# EAGLE design ledshield (EAGLE 7.2.0)
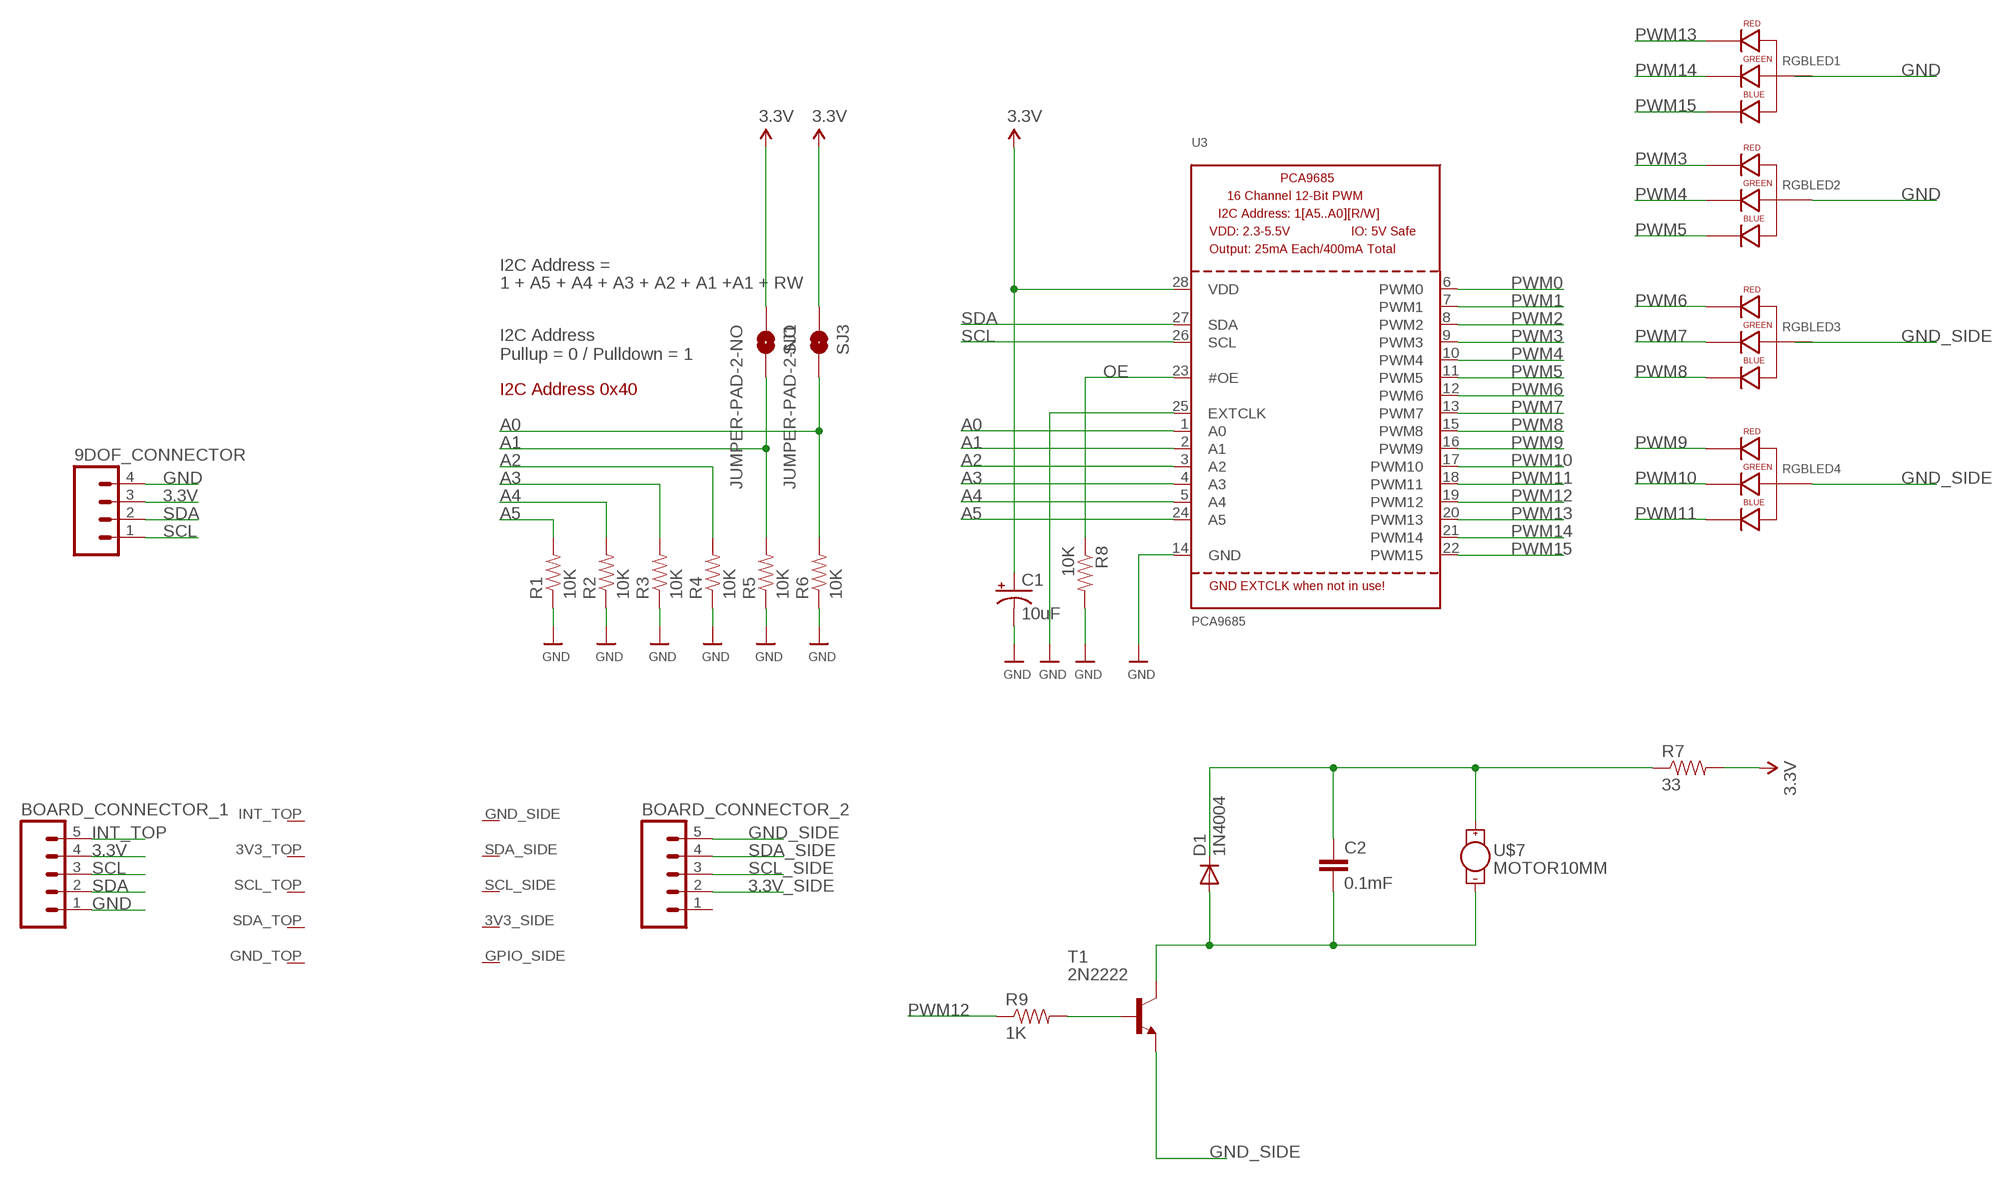
[diagram p0: schematic, sheet 1]

## Parts
9DOF_CONNECTOR  M041.27MM  [1X04-1.27MM]
BOARD_CONNECTOR_1  M051.27MM  [1X05-1.27MM]
BOARD_CONNECTOR_2  M051.27MM  [1X05-1.27MM]
C1  10uF  CAP_POL1206  [EIA3216]
C2  0.1mF  CAP1206  [1206]
D1  1N4004  [DO41-10]
R1  10K  RESISTOR1206  [1206]
R2  10K  RESISTOR1206  [1206]
R3  10K  RESISTOR1206  [1206]
R4  10K  RESISTOR1206  [1206]
R5  10K  RESISTOR1206  [1206]
R6  10K  RESISTOR1206  [1206]
R7  33  RESISTOR1206  [1206]
R8  10K  RESISTOR1206  [1206]
R9  1K  RESISTOR1206  [1206]
RGBLED1  LED-RGB-CA-THRUCLEAR  [LED-RGB-THRU]
RGBLED2  LED-RGB-CA-THRUCLEAR  [LED-RGB-THRU]
RGBLED3  LED-RGB-CA-THRUCLEAR  [LED-RGB-THRU]
RGBLED4  LED-RGB-CA-THRUCLEAR  [LED-RGB-THRU]
SJ1  JUMPER-PAD-2-NO  [PAD-JUMPER-2-NO_NO_SILK]
SJ3  JUMPER-PAD-2-NO  [PAD-JUMPER-2-NO_NO_SILK]
T1  2N2222  [TO92-EBC-OVAL]
U3  PCA9685  [TSSOP28]
U$1  IOT_MODULE_MAIN_V2_PTH  [IOT_MODULE_MAIN_V3_PTH]
U$7  MOTOR10MM  [VIBE-MOTOR-10MM]

## Nets
3.3V: 9DOF_CONNECTOR.3 BOARD_CONNECTOR_1.4 C1.A(+) R7.2 SJ1.1 SJ3.1 U3.28(VDD)
3.3V_SIDE: BOARD_CONNECTOR_2.2
A0: R6.2 SJ3.2 U3.1(A0)
A1: R5.2 SJ1.2 U3.2(A1)
A2: R4.2 U3.3(A2)
A3: R3.2 U3.4(A3)
A4: R2.2 U3.5(A4)
A5: R1.2 U3.24(A5)
GND: 9DOF_CONNECTOR.4 BOARD_CONNECTOR_1.1 C1.C(-) R1.1 R2.1 R3.1 R4.1 R5.1 R6.1 R8.2 RGBLED2.2(ANODE) U3.14(GND) U3.25(EXTCLK)
GND_SIDE: BOARD_CONNECTOR_2.5 RGBLED4.2(ANODE) T1.E
INT_TOP: BOARD_CONNECTOR_1.5
N$1: C2.1 D1.C R7.1 U$7.+
N$2: C2.2 D1.A T1.C U$7.-
N$3: R9.2 T1.B
OE: R8.1 U3.23(#OE)
PWM0: U3.6(PWM0)
PWM1: U3.7(PWM1)
PWM2: U3.8(PWM2)
PWM3: RGBLED2.1(RED_CATHODE) U3.9(PWM3)
PWM4: RGBLED2.3(GREEN_CATHODE) U3.10(PWM4)
PWM5: RGBLED2.4(BLUE_CATHODE) U3.11(PWM5)
PWM6: RGBLED3.1(RED_CATHODE) U3.12(PWM6)
PWM7: RGBLED3.3(GREEN_CATHODE) U3.13(PWM7)
PWM8: RGBLED3.4(BLUE_CATHODE) U3.15(PWM8)
PWM9: RGBLED4.1(RED_CATHODE) U3.16(PWM9)
PWM10: RGBLED4.3(GREEN_CATHODE) U3.17(PWM10)
PWM11: RGBLED4.4(BLUE_CATHODE) U3.18(PWM11)
PWM12: R9.1 U3.19(PWM12)
PWM13: RGBLED1.1(RED_CATHODE) U3.20(PWM13)
PWM14: RGBLED1.3(GREEN_CATHODE) U3.21(PWM14)
PWM15: RGBLED1.4(BLUE_CATHODE) U3.22(PWM15)
SCL: 9DOF_CONNECTOR.1 BOARD_CONNECTOR_1.3 U3.26(SCL)
SCL_SIDE: BOARD_CONNECTOR_2.3
SDA: 9DOF_CONNECTOR.2 BOARD_CONNECTOR_1.2 U3.27(SDA)
SDA_SIDE: BOARD_CONNECTOR_2.4
Unconnected: BOARD_CONNECTOR_2.1 RGBLED1.2(ANODE) RGBLED3.2(ANODE) U$1.3V3_SIDE U$1.3V3_TOP U$1.GND_SIDE U$1.GND_TOP U$1.GPIO_SIDE U$1.INT_TOP U$1.SCL_SIDE U$1.SCL_TOP U$1.SDA_SIDE U$1.SDA_TOP

## Notes on the sheet
- I2C Address =
- 1 + A5 + A4 + A3 + A2 + A1 +A1 + RW
- I2C Address
  Pullup = 0 / Pulldown = 1
- I2C Address 0x40

## Library data of the parts
9DOF_CONNECTOR = SparkFun-Connectors:M04: Header 4 Standard 4-pin 0.1" header. Use with straight break away headers (SKU : PRT-00116), right angle break away headers (PRT-00553), swiss pins (PRT-00743), machine pins (PRT-00117), and female headers (PRT-00115). Molex polarized connector foot print use with SKU : PRT-08231 with associated crimp pins and housings. 1MM SMD Version SKU: PRT-10208
BOARD_CONNECTOR_1 BOARD_CONNECTOR_2 = SparkFun-Connectors:M05: Header 5 Standard 5-pin 0.1" header. Use with straight break away headers (SKU : PRT-00116), right angle break away headers (PRT-00553), swiss pins (PRT-00743), machine pins (PRT-00117), and female headers (PRT-00115). Molex polarized connector foot print use with SKU : PRT-08230 with associated crimp pins and housings.
C1 = SparkFun-Passives:CAP_POL: Capacitor Polarized These are standard SMD and PTH capacitors. Normally 10uF, 47uF, and 100uF in electrolytic and tantalum varieties. Always verify the external diameter of the through hole cap, it varies with capacity, voltage, and manufacturer. The EIA devices should be standard.
C2 = SparkFun-Capacitors:CAP: Capacitor Standard 0603 ceramic capacitor, and 0.1" leaded capacitor.
D1 = adafruit:1N4004: DIODE General purpose 1N400x type rectifier (With bigger pads) http://www.ladyada.net/library/pcb/eaglelibrary.html
R1-R9 = SparkFun-Resistors:RESISTOR: Resistor Basic schematic elements and footprints for 0603, 1206, and PTH resistors.
RGBLED1-RGBLED4 = SparkFun-LED:LED-RGB-CA-THRU: RGB Through-hole common anode SparkFun store front COM-10821 (diffuse) COM-10820 (clear); PROD_ID: DIO-10631
SJ1 SJ3 = SparkFun-Passives:JUMPER-PAD-2-NO
T1 = adafruit:2N2222: NPN TRANSISTOR Big oval pads
U3 = microbuilder:PCA9685: PCA9685 - 16 Channel 12-Bit I2C PWM Controller 5.0V tolerant 16 channel, 12-bit I2C PWM controller with 25mA per output (max. 400mA total) Digikey: 568-5931-1-ND
U$1 = Mlab_ProEx2015:IOT_MODULE_MAIN_V2
U$7 = SparkFun-Electromechanical:MOTOR: Vibration Motor- ROB-08449 Physical dimension and wire connections for this powerful vibration motor. Motor has a self adhesive backing.

## Board
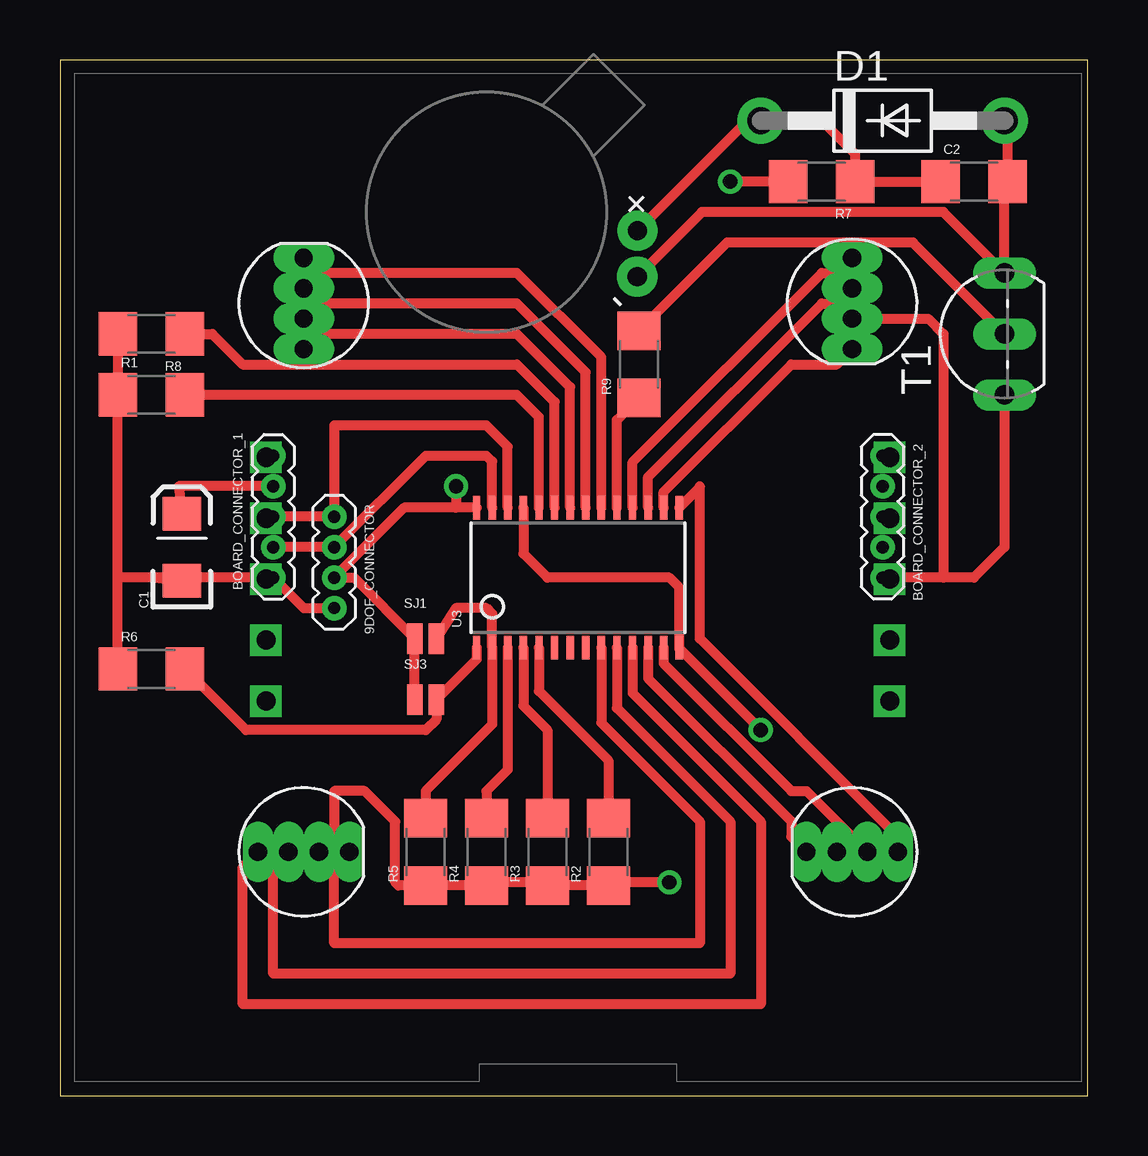
[diagram p1: board, top side]
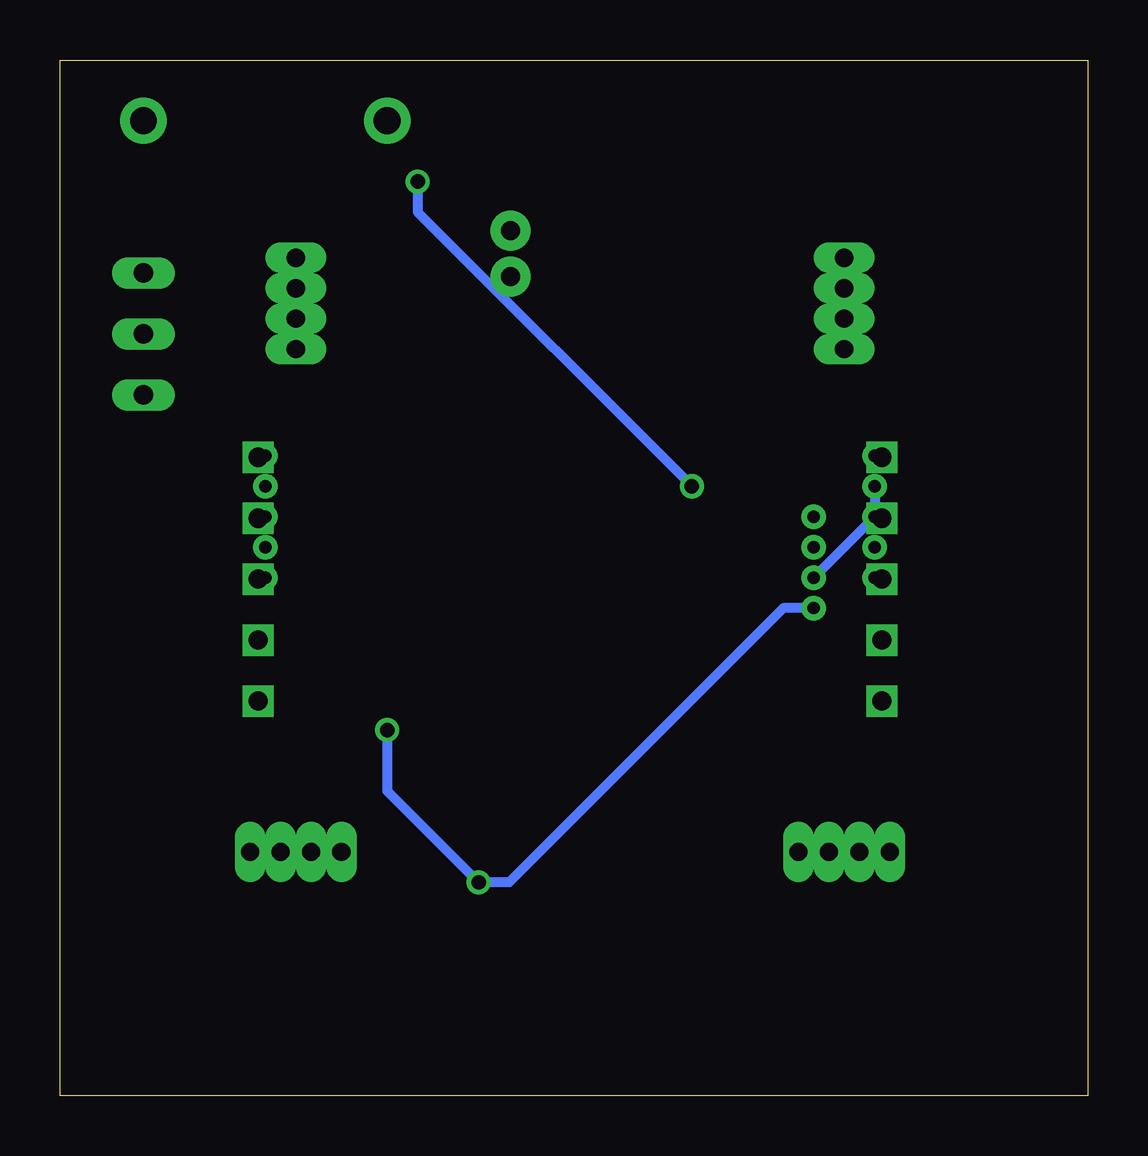
[diagram p2: board, bottom side, seen from below]

Size 42.85 x 43.17 mm. Coordinates in mm from the lower left corner, seen from the top.
Outline: 0,0 42.85,0 42.85,43.17 0,43.17 0,0
Copper layers (1*16): Top 0.035mm / dielectric 1.5mm / Bottom 0.035mm
Design rules "default": minimum track width 10mil, minimum drill 24mil, track to track 8mil, track to pad 8mil, pad to pad 8mil, via to via 8mil, smd to smd 8mil, copper to edge 40mil, drill to drill 8mil, minimum pad ring 10mil, minimum via ring 8mil, stop-mask expansion 4mil, vias tented up to drill 0mil, thermal gap 10mil

### Footprints (pad centres in the part's own frame; a part is rotated, then mirrored left to right if it is on the bottom)
1X04-1.27MM = drill 0.508 pad 1: 1 0,0; 2 1.27,0; 3 2.54,0; 4 3.81,0
1X05-1.27MM = drill 0.508 pad 1: 1 0,0; 2 1.27,0; 3 2.54,0; 4 3.81,0; 5 5.08,0
EIA3216 = smd 1.4 x 1.6: A 1.4,0; C -1.4,0
1206 = smd 1.6 x 1.8: 1 -1.4,0; 2 1.4,0
DO41-10 = drill 1.118 pad 1.93: A 5.08,0; C -5.08,0
LED-RGB-THRU = drill 0.762 pad 0.889 long: 1 1.905,0; 2 0.635,0; 3 -0.635,0; 4 -1.905,0
PAD-JUMPER-2-NO_NO_SILK = smd 0.635 x 1.27: 1 -0.45,0; 2 0.45,0
TO92-EBC-OVAL = drill 0.813 long: B 0,-1.27; C 2.54,-1.27; E -2.54,-1.27
TSSOP28 = smd 0.305 x 0.991: 1 -4.225,-2.918; 2 -3.575,-2.918; 3 -2.925,-2.918; 4 -2.275,-2.918; 5 -1.625,-2.918; 6 -0.975,-2.918; 7 -0.325,-2.918; 8 0.325,-2.918; 9 0.975,-2.918; 10 1.625,-2.918; 11 2.275,-2.918; 12 2.925,-2.918; 13 3.575,-2.918; 14 4.225,-2.918; 15 4.225,2.918; 16 3.575,2.918; 17 2.925,2.918; 18 2.275,2.918; 19 1.625,2.918; 20 0.975,2.918; 21 0.325,2.918; 22 -0.325,2.918; 23 -0.975,2.918; 24 -1.625,2.918; 25 -2.275,2.918; 26 -2.925,2.918; 27 -3.575,2.918; 28 -4.225,2.918
IOT_MODULE_MAIN_V3_PTH = drill 0.8 square: 3V3_SIDE 13,-2.601; 3V3_TOP -13,2.479; GND_SIDE 13,5.019; GND_TOP -13,-5.141; GPIO_SIDE 13,-5.141; INT_TOP -13,5.019; SCL_SIDE 13,-0.061; SCL_TOP -13,-0.061; SDA_SIDE 13,2.479; SDA_TOP -13,-2.601
VIBE-MOTOR-10MM = drill 0.8 pad 1.676: + -5,-3.9; - -6.35,-2.54

### Placement (x,y rotation side)
9DOF_CONNECTOR  11.43,24.13 270 top
BOARD_CONNECTOR_1  8.89,21.59 90 top
BOARD_CONNECTOR_2  34.29,26.67 270 top
C1  5.08,22.86 90 top
C2  38.1,38.1 0 top
D1  34.29,40.64 0 top
R1  3.81,29.21 0 top
R2  22.86,10.16 90 top
R3  20.32,10.16 90 top
R4  17.78,10.16 90 top
R5  15.24,10.16 90 top
R6  3.81,17.78 0 top
R7  31.75,38.1 180 top
R8  3.81,31.75 180 top
R9  24.13,30.48 90 top
RGBLED1  10.16,33.02 90 top
RGBLED2  10.16,10.16 0 top
RGBLED3  33.02,10.16 180 top
RGBLED4  33.02,33.02 270 top
SJ1  15.24,19.05 0 top
SJ3  15.24,16.51 0 top
T1  38.1,31.75 90 top
U3  21.59,21.59 0 top
U$1  21.59,21.59 0 top
U$7  17.78,36.83 135 top

### Tracks (layer width: path | path; a pad name or v marks a point on that pad's centre or on a via)
3.3V  (via drill 0.6)
  Top 0.406: BOARD_CONNECTOR_1.4 4.95,25.4 C1.A | SJ3.1 SJ1.1 12.25,21.59 9DOF_CONNECTOR.3 14.35,24.51 16.51,24.51 | U3.28 16.51,24.51 | R7.2 v27.94,38.1 | v16.51,25.4 16.51,24.51
  Bottom 0.406: BOARD_CONNECTOR_1.4 8.89,24.13 9DOF_CONNECTOR.3 | v27.94,38.1 27.94,36.83 v16.51,25.4
A0
  Top 0.406: U3.1 17.36,18.18 SJ3.2 15.69,15.69 15.24,15.24 7.75,15.24 R6.2
A1
  Top 0.406: R5.2 15.24,12.7 18.02,15.47 U3.2 18.02,20.09 17.78,20.32 16.51,20.32 SJ1.2
A2
  Top 0.406: U3.3 18.66,13.59 17.78,12.7 R4.2
A3
  Top 0.406: U3.4 19.32,16.25 20.32,15.24 R3.2
A4
  Top 0.406: U3.5 19.96,16.86 22.86,13.97 R2.2
A5
  Top 0.406: U3.24 19.96,28.3 19.05,29.21 R1.2
GND  (via drill 0.6)
  Top 0.406: R8.2 R1.1 2.41,21.59 | 9DOF_CONNECTOR.4 10.16,20.32 BOARD_CONNECTOR_1.1 3.94,21.59 | 3.94,21.59 C1.C | v29.21,15.24 25.82,18.64 U3.14 25.82,21.18 25.4,21.59 20.32,21.59 19.32,22.59 U3.25 | v25.4,8.89 22.99,8.89 R2.1 R3.1 20.32,8.89 17.91,8.89 R4.1 R5.1 14.1,8.76 13.97,8.89 13.97,11.43 12.7,12.7 11.43,12.7 11.43,10.79 RGBLED2.2 | R6.1 2.41,21.59 | 3.94,21.59 2.41,21.59
  Bottom 0.406: v29.21,15.24 29.21,12.7 v25.4,8.89 24.13,8.89 12.7,20.32 9DOF_CONNECTOR.4
GND_SIDE
  Top 0.406: T1.E 39.37,22.86 38.1,21.59 36.83,21.59 | 36.83,21.59 BOARD_CONNECTOR_2.5 | RGBLED4.2 36.2,32.38 36.83,31.75 36.83,21.59
N$1
  Top 0.406: R7.1 33.02,38.1 | R7.1 C2.1 | R7.1 33.15,39.24 31.75,40.64 D1.C 28.66,40.64 U$7.+
N$2
  Top 0.406: D1.A 39.5,40.51 C2.2 39.37,37.97 T1.C 36.83,36.83 26.76,36.83 U$7.-
N$3
  Top 0.406: T1.B 35.56,35.56 27.81,35.56 R9.2
OE
  Top 0.406: U3.23 20.61,28.91 19.05,30.48 7.62,30.48 6.35,31.75 R8.1
PWM3
  Top 0.406: U3.9 22.57,15.54 26.67,11.43 26.67,6.35 11.43,6.35 11.43,9.53 RGBLED2.1
PWM4
  Top 0.406: U3.10 23.21,16.16 27.94,11.43 27.94,5.08 8.89,5.08 8.89,9.53 RGBLED2.3
PWM5
  Top 0.406: U3.11 23.86,16.77 29.21,11.43 29.21,3.81 7.62,3.81 7.62,9.53 RGBLED2.4
PWM6
  Top 0.406: U3.12 24.52,17.39 30.48,11.43 30.48,10.79 RGBLED3.1
PWM7
  Top 0.406: U3.13 25.16,18.02 30.48,12.7 31.11,12.7 RGBLED3.3
PWM8
  Top 0.406: RGBLED3.4 34.92,10.79 26.67,19.05 26.67,25.36 | 26.67,25.4 26.67,25.36 | 26.67,25.36 U3.15
PWM9
  Top 0.406: U3.16 25.16,25.16 30.48,30.48 32.38,30.48 RGBLED4.1
PWM10
  Top 0.406: U3.17 24.52,25.79 31.75,33.02 32.38,33.02 RGBLED4.3
PWM11
  Top 0.406: U3.18 23.86,26.41 31.75,34.29 32.38,34.29 RGBLED4.4
PWM12
  Top 0.406: U3.19 23.21,28.16 R9.1
PWM13
  Top 0.406: U3.20 22.57,30.77 19.05,34.29 10.79,34.29 RGBLED1.1
PWM14
  Top 0.406: U3.21 21.91,30.16 19.05,33.02 10.79,33.02 RGBLED1.3
PWM15
  Top 0.406: U3.22 21.27,29.54 19.05,31.75 10.79,31.75 RGBLED1.4
SCL
  Top 0.406: BOARD_CONNECTOR_1.3 9DOF_CONNECTOR.1 11.43,27.94 17.78,27.94 18.66,27.05 U3.26
SDA
  Top 0.406: BOARD_CONNECTOR_1.2 9DOF_CONNECTOR.2 15.24,26.67 17.78,26.67 18.02,26.43 U3.27